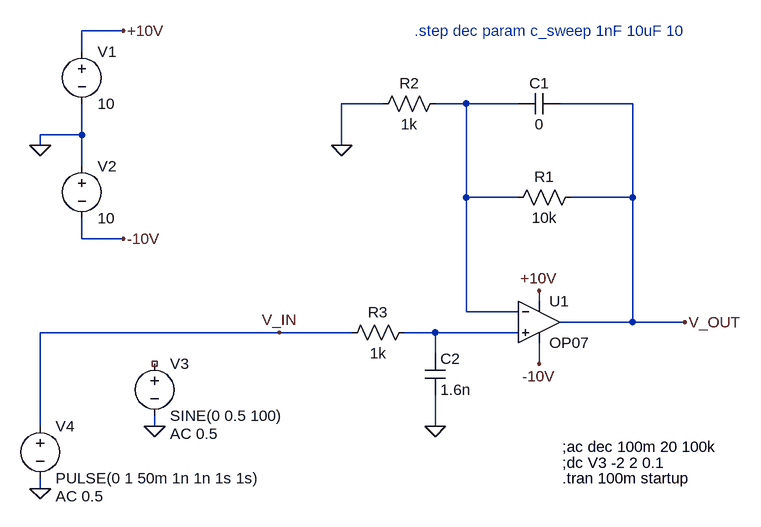
[diagram p0: schematic Lab 1 Amplifier V1.asc]
Lab 1 Amplifier V1.asc, the LTspice schematic file:
Version 4
SHEET 1 880 680
WIRE -240 -384 -304 -384
WIRE -304 -352 -304 -384
WIRE 160 -272 96 -272
WIRE 288 -272 240 -272
WIRE 368 -272 288 -272
WIRE 544 -272 432 -272
WIRE -304 -224 -304 -272
WIRE -304 -224 -368 -224
WIRE -368 -208 -368 -224
WIRE 96 -208 96 -272
WIRE -304 -176 -304 -224
WIRE 288 -128 288 -272
WIRE 368 -128 288 -128
WIRE 544 -128 544 -272
WIRE 544 -128 448 -128
WIRE -304 -64 -304 -96
WIRE -240 -64 -304 -64
WIRE 400 32 400 16
WIRE 288 48 288 -128
WIRE 368 48 288 48
WIRE 544 64 544 -128
WIRE 544 64 432 64
WIRE 624 64 544 64
WIRE 0 80 -368 80
WIRE 112 80 0 80
WIRE 240 80 192 80
WIRE 368 80 240 80
WIRE 240 112 240 80
WIRE 400 128 400 96
WIRE -368 224 -368 80
WIRE -192 224 -192 208
WIRE 240 224 240 176
WIRE -368 320 -368 304
FLAG -368 -208 0
FLAG -240 -384 +10V
FLAG -240 -64 -10V
FLAG 400 16 +10V
FLAG 400 128 -10V
FLAG 0 80 V_IN
FLAG 624 64 V_OUT
FLAG -192 224 0
FLAG 96 -208 0
FLAG 240 224 0
FLAG -368 320 0
SYMBOL OpAmps\\OP07 400 0 R0
SYMATTR InstName U1
SYMBOL voltage -304 -368 R0
WINDOW 123 0 0 Left 0
WINDOW 39 0 0 Left 0
SYMATTR InstName V1
SYMATTR Value 10
SYMBOL voltage -304 -192 R0
WINDOW 123 0 0 Left 0
WINDOW 39 0 0 Left 0
SYMATTR InstName V2
SYMATTR Value 10
SYMBOL res 464 -144 R90
WINDOW 0 0 56 VBottom 2
WINDOW 3 32 56 VTop 2
SYMATTR InstName R1
SYMATTR Value 10k
SYMBOL res 144 -256 R270
WINDOW 0 32 56 VTop 2
WINDOW 3 0 56 VBottom 2
SYMATTR InstName R2
SYMATTR Value 1k
SYMBOL voltage -192 112 R0
WINDOW 123 24 124 Left 2
WINDOW 39 0 0 Left 0
SYMATTR InstName V3
SYMATTR Value SINE(0 0.5 100)
SYMATTR Value2 AC 0.5
SYMBOL cap 432 -288 R90
WINDOW 0 0 32 VBottom 2
WINDOW 3 32 32 VTop 2
SYMATTR InstName C1
SYMATTR Value 0
SYMBOL res 208 64 R90
WINDOW 0 0 56 VBottom 2
WINDOW 3 32 56 VTop 2
SYMATTR InstName R3
SYMATTR Value 1k
SYMBOL cap 224 112 R0
SYMATTR InstName C2
SYMATTR Value 1.6n
SYMBOL voltage -368 208 R0
WINDOW 123 24 124 Left 2
WINDOW 39 0 0 Left 0
SYMATTR InstName V4
SYMATTR Value PULSE(0 1 50m 1n 1n 1s 1s)
SYMATTR Value2 AC 0.5
TEXT 436 280 Left 2 !;dc V3 -2 2 0.1
TEXT 208 -384 Left 2 ;.step dec param c_sweep 1nF 10uF 10
TEXT 436 304 Left 2 !.tran 100m startup
TEXT 436 256 Left 2 !;ac dec 100m 20 100k

The netlist it stands for:
* Lab 1 Amplifier V1.asc
XU1 N002 N001 +10V -10V V_OUT LT1001  ; OP07, pins In+ In- V+ V- OUT
V1 +10V 0 10
V2 0 -10V 10
R1 V_OUT N001 10k
R2 0 N001 1k
V3 NC_01 0 SINE(0 0.5 100) AC 0.5
C1 V_OUT N001 0
R3 N002 V_IN 1k
C2 N002 0 1.6n
V4 V_IN 0 PULSE(0 1 50m 1n 1n 1s 1s) AC 0.5
;dc V3 -2 2 0.1
* .step dec param c_sweep 1nF 10uF 10
.tran 100m startup
;ac dec 100m 20 100k
.lib LTC.lib
.backanno
.end